# EAGLE design LME49600_HPA (EAGLE 7.2.0)
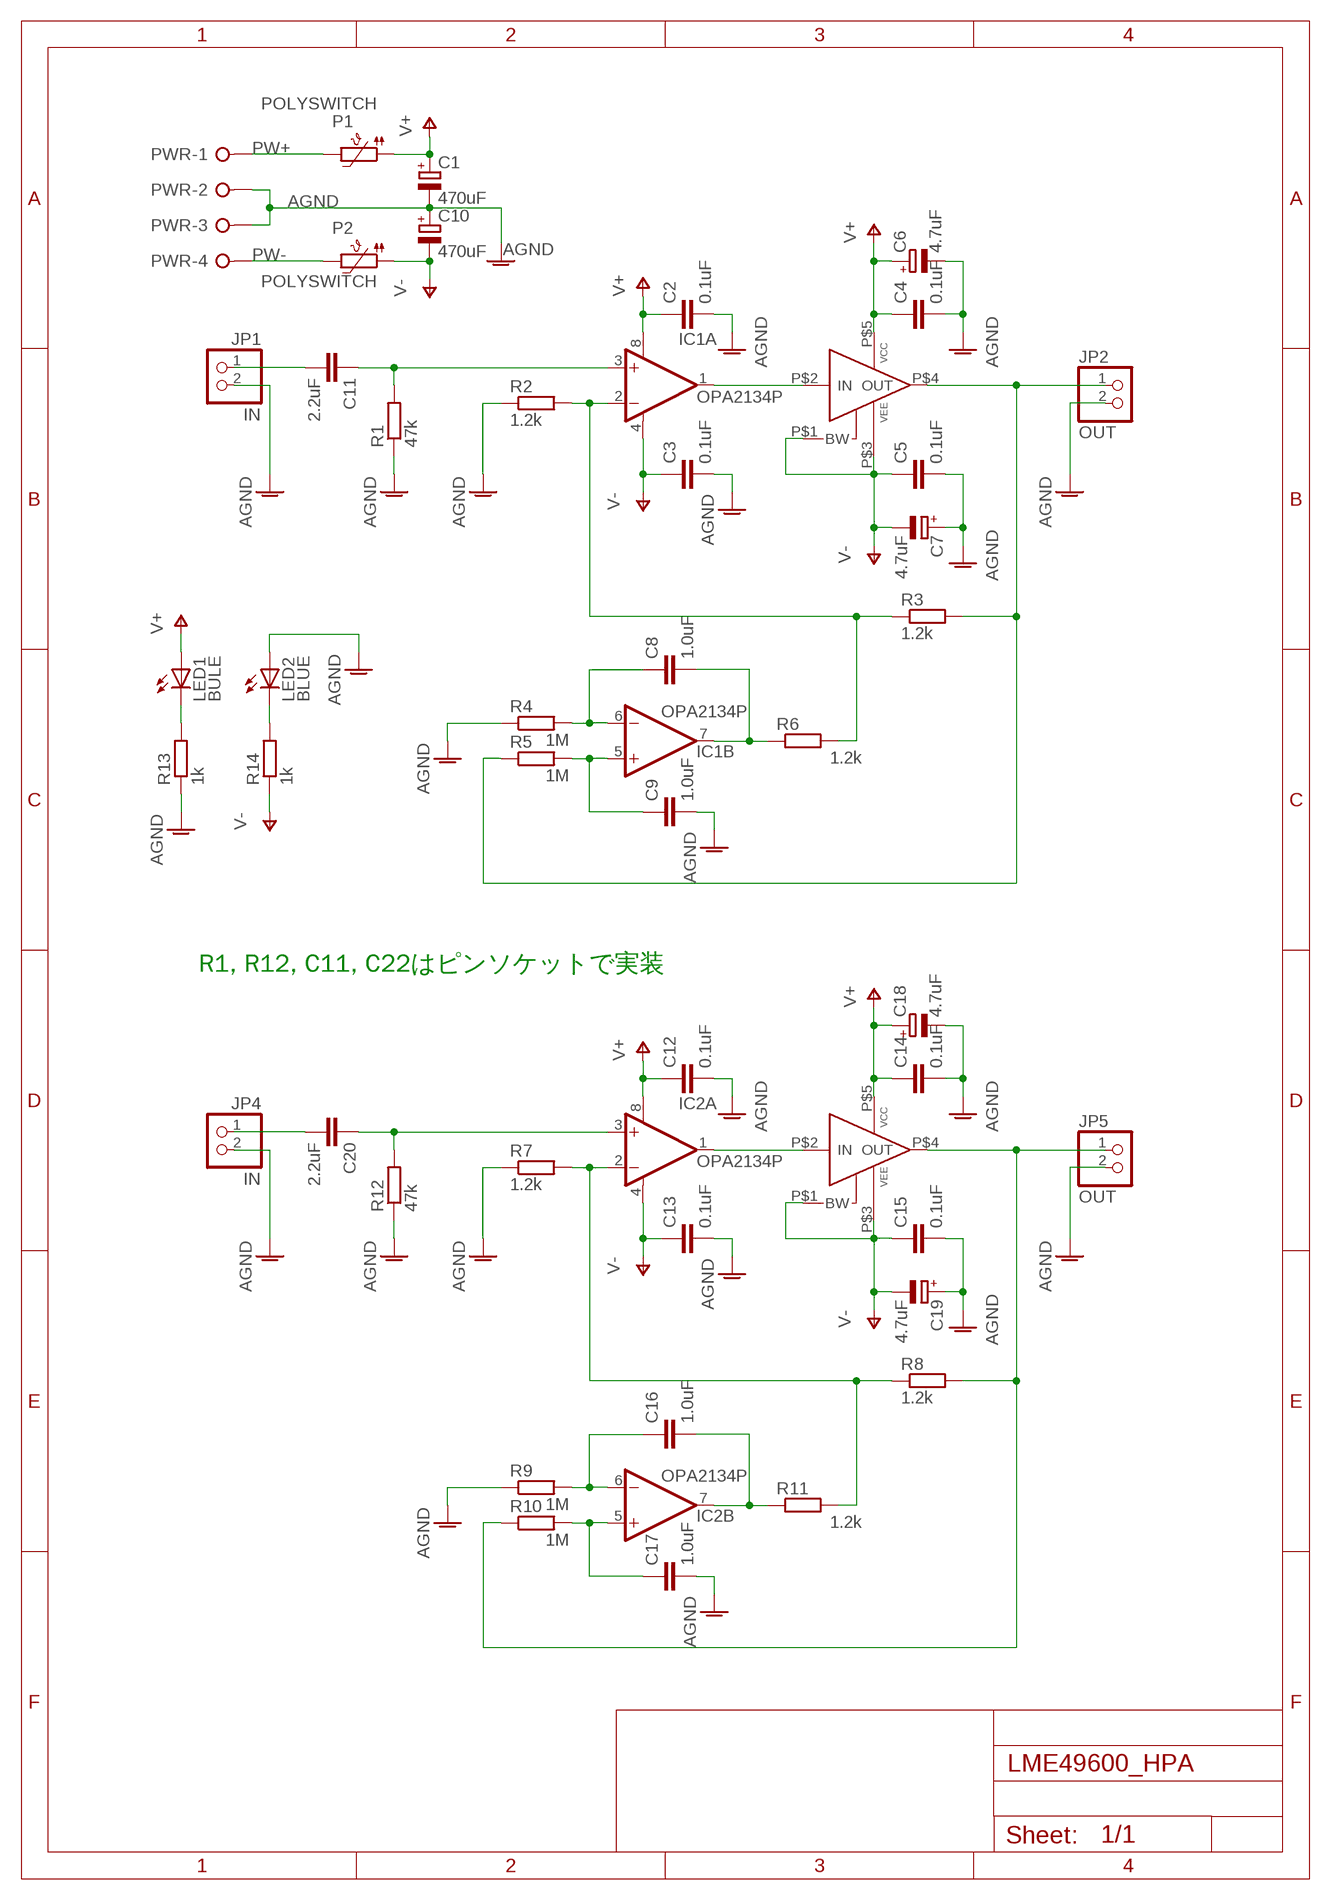
[diagram p0: schematic, sheet 1]

## Parts
C1  470uF  CPOL-EUE7.5-16  [E7,5-16]
C2  0.1uF  C-EU075-042X103  [C075-042X103]
C3  0.1uF  C-EU075-042X103  [C075-042X103]
C4  0.1uF  C-EU050H075X075  [C050H075X075]
C5  0.1uF  C-EU050H075X075  [C050H075X075]
C6  4.7uF  CPOL-EUE2-4  [E2-4]
C7  4.7uF  CPOL-EUE2-4  [E2-4]
C8  1.0uF  C-EU050-050X075  [C050-050X075]
C9  1.0uF  C-EU050-050X075  [C050-050X075]
C10  470uF  CPOL-EUE7.5-16  [E7,5-16]
C11  2.2uF  C-EU050-055X075  [C050-055X075]
C12  0.1uF  C-EU075-042X103  [C075-042X103]
C13  0.1uF  C-EU075-042X103  [C075-042X103]
C14  0.1uF  C-EU050H075X075  [C050H075X075]
C15  0.1uF  C-EU050H075X075  [C050H075X075]
C16  1.0uF  C-EU050-050X075  [C050-050X075]
C17  1.0uF  C-EU050-050X075  [C050-050X075]
C18  4.7uF  CPOL-EUE2-4  [E2-4]
C19  4.7uF  CPOL-EUE2-4  [E2-4]
C20  2.2uF  C-EU050-055X075  [C050-055X075]
IC1  OPA2134P  [DIL08]
IC2  OPA2134P  [DIL08]
JP1  IN  PINHD-1X2  [1X02]
JP2  OUT  PINHD-1X2  [1X02]
JP4  IN  PINHD-1X2  [1X02]
JP5  OUT  PINHD-1X2  [1X02]
LED1  BULE  LED3MM  [LED3MM]
LED2  BLUE  LED3MM  [LED3MM]
P1  POLYSWITCH  [POLYSWITCH]
P2  POLYSWITCH  [POLYSWITCH]
PWR  W237-04P  [W237-4P]
R1  47k  R-EU_0207/7  [0207/7]
R2  1.2k  R-EU_0207/7  [0207/7]
R3  1.2k  R-EU_0207/7  [0207/7]
R4  1M  R-EU_0207/7  [0207/7]
R5  1M  R-EU_0207/7  [0207/7]
R6  1.2k  R-EU_0207/7  [0207/7]
R7  1.2k  R-EU_0207/7  [0207/7]
R8  1.2k  R-EU_0207/7  [0207/7]
R9  1M  R-EU_0207/7  [0207/7]
R10  1M  R-EU_0207/7  [0207/7]
R11  1.2k  R-EU_0207/7  [0207/7]
R12  47k  R-EU_0207/7  [0207/7]
R13  1k  R-EU_0207/7  [0207/7]
R14  1k  R-EU_0207/7  [0207/7]
U$1  LME49600-BRD2  [SIP5-9]
U$2  LME49600-BRD2  [SIP5-9]

## Nets
AGND: C1.- C2.2 C3.2 C4.2 C5.2 C6.- C7.+ C9.2 C10.+ C12.2 C13.2 C14.2 C15.2 C17.2 C18.- C19.+ JP1.2 JP2.2 JP4.2 JP5.2 LED2.A PWR.2 PWR.3 R1.1 R2.1 R4.1 R7.1 R9.1 R12.1 R13.1
N$1: C11.2 JP1.1
N$2: C11.1 IC1.3(A:+IN) R1.2
N$3: IC1.2(A:-IN) R2.2 R3.1 R6.2
N$4: IC2.2(A:-IN) R7.2 R8.1 R11.2
N$5: IC2.1(A:OUT) U$2.P$2(IN)
N$6: C8.1 IC1.6(B:-IN) R4.2
N$7: IC1.1(A:OUT) U$1.P$2(IN)
N$8: C9.1 IC1.5(B:+IN) R5.2
N$9: C16.1 IC2.6(B:-IN) R9.2
N$10: C17.1 IC2.5(B:+IN) R10.2
N$11: C8.2 IC1.7(B:OUT) R6.1
N$12: C16.2 IC2.7(B:OUT) R11.1
N$13: JP5.1 R8.2 R10.1 U$2.P$4(OUT)
N$14: JP2.1 R3.2 R5.1 U$1.P$4(OUT)
N$15: C20.2 JP4.1
N$16: C20.1 IC2.3(A:+IN) R12.2
N$17: LED1.K(C) R13.2
N$19: LED2.K(C) R14.2
PW+: P1.2 PWR.1
PW-: P2.2 PWR.4
V+: C1.+ C2.1 C4.1 C6.+ C12.1 C14.1 C18.+ IC1.8(A:V+) IC2.8(A:V+) LED1.A P1.1 U$1.P$5(VCC) U$2.P$5(VCC)
V-: C3.1 C5.1 C7.- C10.- C13.1 C15.1 C19.- IC1.4(A:V-) IC2.4(A:V-) P2.1 R14.1 U$1.P$1(BW) U$1.P$3(VEE) U$2.P$1(BW) U$2.P$3(VEE)

## Notes on the sheet
- R1, R12, C11, C22はピンソケットで実装

## Library data of the parts
C1 C6 C7 C10 C18 C19 = rcl:CPOL-EU: POLARIZED CAPACITOR, European symbol
C2-C5 C8 C9 C11-C17 C20 = rcl:C-EU: CAPACITOR, European symbol
IC1 IC2 = burr-brown:OPA2134: Operational Amplifier; MF: TEXAS INSTRUMENTS; MPN: OPA2134PA; OC_FARNELL: 1097574; OC_NEWARK: 74K3897
JP1 JP2 JP4 JP5 = pinhead:PINHD-1X2: PIN HEADER
LED1 LED2 = led:LED: LED OSRAM: - CHIPLED LG R971, LG N971, LY N971, LG Q971, LY Q971, LO R971, LY R971 LH N974, LH R974 LS Q976, LO Q976, LY Q976 LO Q996 - Hyper CHIPLED LW Q18S LB Q993, LB Q99A, LB R99A - SideLED LS A670, LO A670, LY A670, LG A670, LP A670 LB A673, LV A673, LT A673, LW A673 LH A674 LY A675 LS A676, LA A676, LO A676, LY A676, LW A676 LS A679, LY A679, LG A679 - Hyper Micro SIDELED® LS Y876, LA Y876, LO Y876, LY Y876 LT Y87S - SmartLED LW L88C, LW L88S LB L89C, LB L89S, LG L890 LS L89K, LO L89K, LY L89K LS L896, LA L896, LO L896, LY L896 - TOPLED LS T670, LO T670, LY T670, LG T670, LP T670 LSG T670, LSP T670, LSY T670, LOP T670, LYG T670 LG T671, LOG T671, LSG T671 LB T673, LV T673, LT T673, LW T673 LH T674 LS T676, LA T676, LO T676, LY T676, LB T676, LH T676, LSB T676, LW T676 LB T67C, LV T67C, LT T67C, LS T67K, LO T67K, LY T67K, LW E67C LS E67B, LA E67B, LO E67B, LY E67B, LB E67C, LV E67C, LT E67C LW T67C LS T679, LY T679, LG T679 LS T770, LO T770, LY T770, LG T770, LP T770 LB T773, LV T773, LT T773, LW T773 LH T774 LS E675, LA E675, LY E675, LS T675 LS T776, LA T776, LO T776, LY T776, LB T776 LHGB T686 LT T68C, LB T68C - Hyper Mini TOPLED® LB M676 - Mini TOPLED Santana® LG M470 LS M47K, LO M47K, LY M47K Source: http://www.osram.convergy.de LUXEON: - LUMILED® LXK2-PW12-R00, LXK2-PW12-S00, LXK2-PW14-U00, LXK2-PW14-V00 LXK2-PM12-R00, LXK2-PM12-S00, LXK2-PM14-U00 LXK2-PE12-Q00, LXK2-PE12-R00, LXK2-PE12-S00, LXK2-PE14-T00, LXK2-PE14-U00 LXK2-PB12-K00, LXK2-PB12-L00, LXK2-PB12-M00, LXK2-PB14-N00, LXK2-PB14-P00, LXK2-PB14-Q00 LXK2-PR12-L00, LXK2-PR12-M00, LXK2-PR14-Q00, LXK2-PR14-R00 LXK2-PD12-Q00, LXK2-PD12-R00, LXK2-PD12-S00 LXK2-PH12-R00, LXK2-PH12-S00 LXK2-PL12-P00, LXK2-PL12-Q00, LXK2-PL12-R00 Source: www.luxeon.com KINGBRIGHT: KA-3528ASYC Source: www.kingbright.com
P1 P2 = mylib2:POLYSWITCH
PWR = con-wago-508:W237-04P: WAGO SREW CLAMP; OC_FARNELL: unknown; OC_NEWARK: unknown
R1-R14 = rcl:R-EU_: RESISTOR, European symbol
U$1 U$2 = mylib2:LME49600-BRD2

## Board
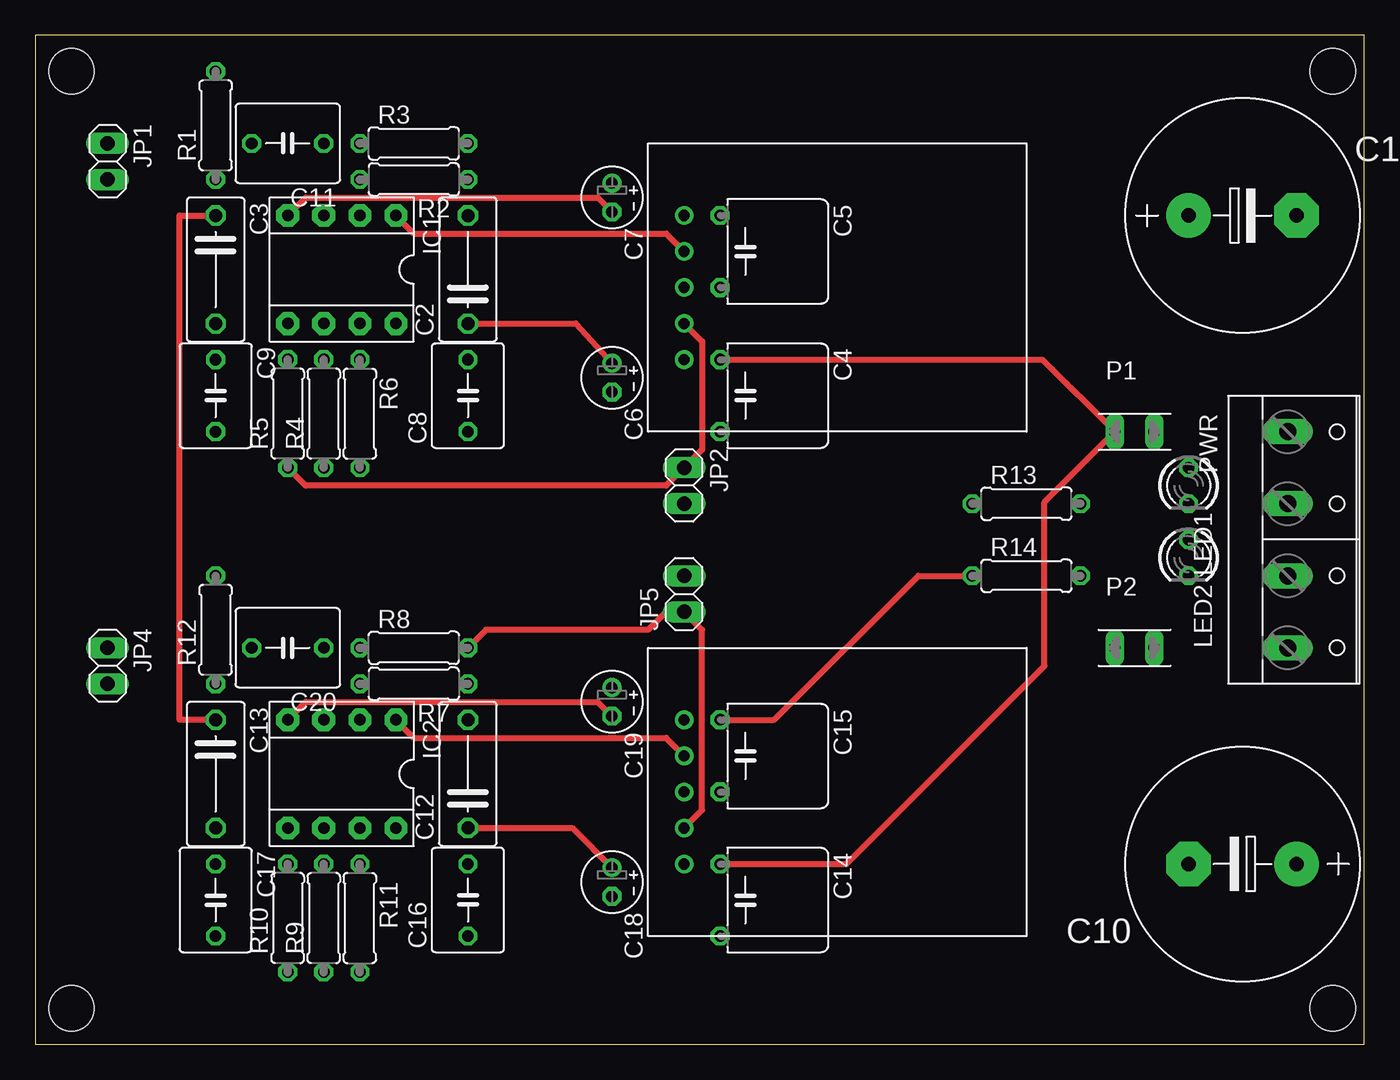
[diagram p1: board, top side]
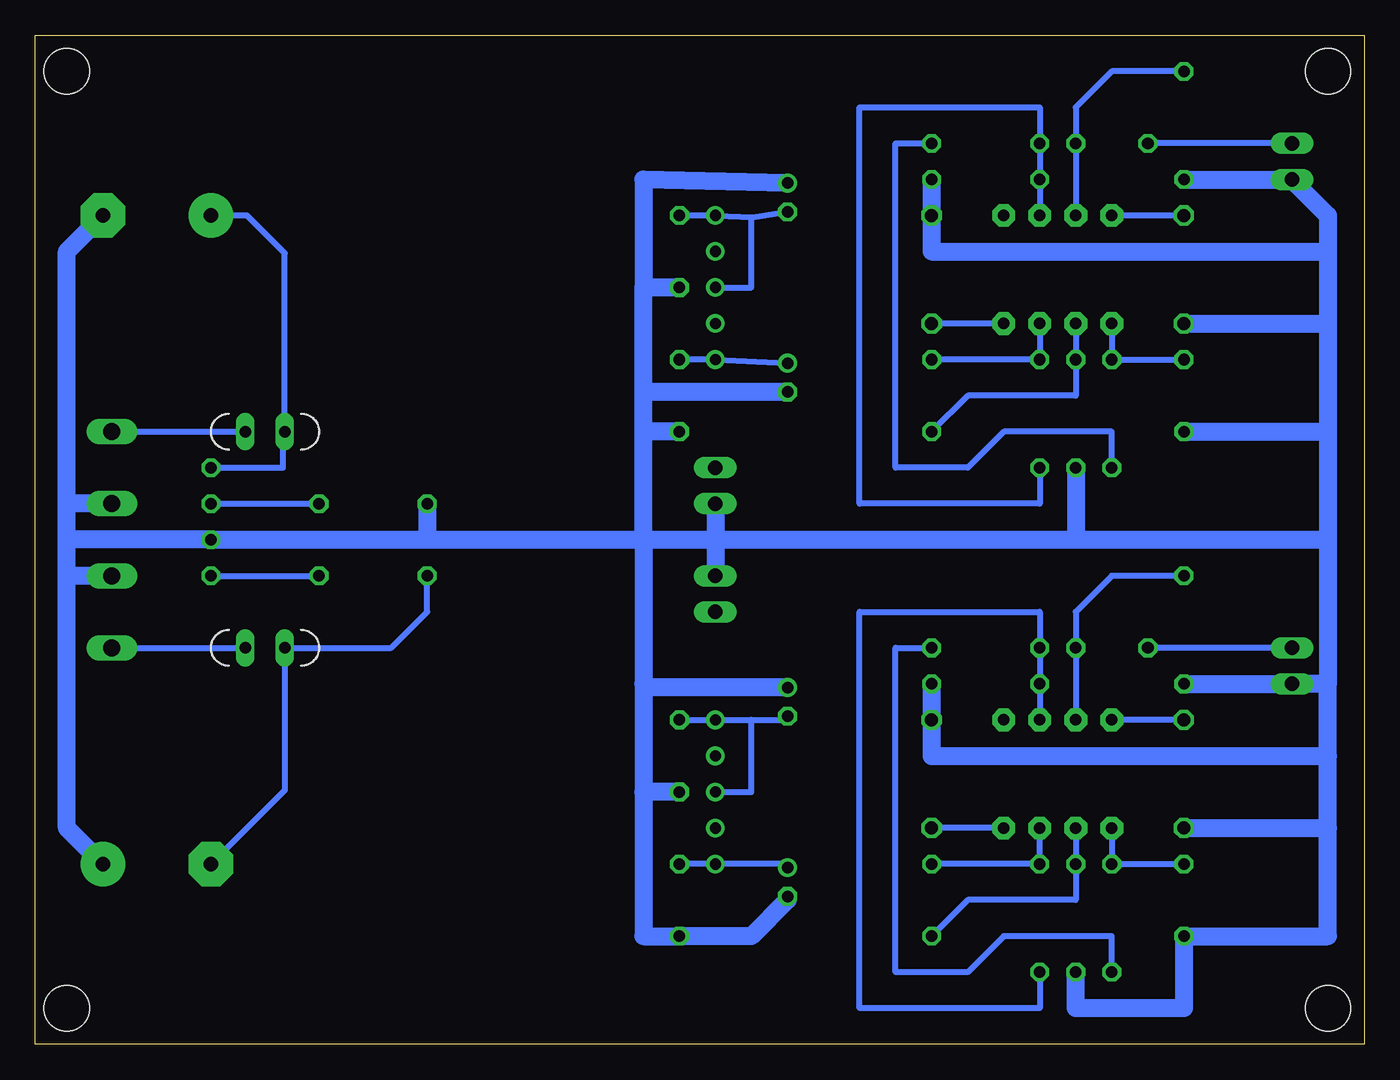
[diagram p2: board, bottom side, seen from below]

Size 93.65 x 71.11 mm. Coordinates in mm from the lower left corner, seen from the top.
Outline: 0,0 93.65,0 93.65,71.11 0,71.11 0,0
Copper layers (1*16): Top 0.035mm / dielectric 1.5mm / Bottom 0.035mm
Design rules "default": minimum track width 10mil, minimum drill 24mil, track to track 8mil, track to pad 8mil, pad to pad 8mil, via to via 8mil, smd to smd 8mil, copper to edge 40mil, drill to drill 8mil, minimum pad ring 10mil, minimum via ring 8mil, stop-mask expansion 4mil, vias tented up to drill 0mil, thermal gap 10mil
Holes 3.2 mm at 2.54,68.58 2.54,2.54 91.44,2.54 91.44,68.58

### Footprints (pad centres in the part's own frame; a part is rotated, then mirrored left to right if it is on the bottom)
E7,5-16 = drill 1.016 pad 3.15: + -3.81,0 | drill 1.016 pad 3.15 octagon: - 3.81,0
C075-042X103 = drill 0.914 octagon: 1 -3.81,0; 2 3.81,0
C050H075X075 = drill 0.813 octagon: 1 -2.54,0; 2 2.54,0
E2-4 = drill 0.813 pad 1.27: + -1.016,0 | drill 0.813 pad 1.27 octagon: - 1.016,0
C050-050X075 = drill 0.813 octagon: 1 -2.54,0; 2 2.54,0
C050-055X075 = drill 0.813 octagon: 1 -2.54,0; 2 2.54,0
DIL08 = drill 0.813 pad 1.6 octagon: 1 -3.81,-3.81; 2 -1.27,-3.81; 3 1.27,-3.81; 4 3.81,-3.81; 5 3.81,3.81; 6 1.27,3.81; 7 -1.27,3.81; 8 -3.81,3.81
1X02 = drill 1.016 long: 1 -1.27,0; 2 1.27,0
LED3MM = drill 0.813 octagon: A -1.27,0; K 1.27,0
POLYSWITCH = drill 0.813 long: 1 -1.397,0; 2 1.397,0
W237-4P = drill 1.194 long: 1 -7.62,-0.635; 2 -2.54,-0.635; 3 2.54,-0.635; 4 7.62,-0.635
0207/7 = drill 0.813 octagon: 1 -3.81,0; 2 3.81,0
SIP5-9 = drill 0.8: P$1 -5.08,-7.62; P$2 -2.54,-7.62; P$3 0,-7.62; P$4 2.54,-7.62; P$5 5.08,-7.62

### Placement (x,y rotation side)
C1  85.09,58.42 0 top
C2  30.48,54.61 90 top
C3  12.7,54.61 270 top
C4  48.26,45.72 270 top
C5  48.26,55.88 270 top
C6  40.64,46.99 270 top
C7  40.64,59.69 270 top
C8  30.48,45.72 90 top
C9  12.7,45.72 270 top
C10  85.09,12.7 180 top
C11  17.78,63.5 180 top
C12  30.48,19.05 90 top
C13  12.7,19.05 270 top
C14  48.26,10.16 270 top
C15  48.26,20.32 270 top
C16  30.48,10.16 90 top
C17  12.7,10.16 270 top
C18  40.64,11.43 270 top
C19  40.64,24.13 270 top
C20  17.78,27.94 180 top
IC1  21.59,54.61 180 top
IC2  21.59,19.05 180 top
JP1  5.08,62.23 270 top
JP2  45.72,39.37 270 top
JP4  5.08,26.67 270 top
JP5  45.72,31.75 90 top
LED1  81.28,39.37 270 top
LED2  81.28,34.29 270 top
P1  77.47,43.18 0 top
P2  77.47,27.94 0 top
PWR  88.9,35.56 270 top
R1  12.7,64.77 90 top
R2  26.67,60.96 180 top
R3  26.67,63.5 0 top
R4  20.32,44.45 90 top
R5  17.78,44.45 90 top
R6  22.86,44.45 270 top
R7  26.67,25.4 180 top
R8  26.67,27.94 0 top
R9  20.32,8.89 90 top
R10  17.78,8.89 90 top
R11  22.86,8.89 270 top
R12  12.7,29.21 90 top
R13  69.85,38.1 0 top
R14  69.85,33.02 0 top
U$1  53.34,53.34 270 top
U$2  53.34,17.78 270 top

### Tracks (layer width: path | path; a pad name or v marks a point on that pad's centre or on a via)
AGND
  Bottom 0.406: 50.55,25.15 50.8,25.4 | R2.1 C2.2 | C18.- 40.64,10.16
  Bottom 1.27: R12.1 JP4.2 2.54,25.4 | C13.2 2.54,15.24 | 2.54,15.24 2.54,7.62 C17.2 12.7,2.54 20.32,2.54 R9.1 | C19.+ 50.55,25.15 | 50.8,17.78 50.8,25.4 50.8,35.56 | 2.54,15.24 2.54,20.32 | 2.54,20.32 2.54,25.4 | 2.54,55.88 2.54,58.42 JP1.2 R1.1 | 2.54,55.88 2.54,50.8 | 2.54,50.8 2.54,43.18 | 2.54,43.18 2.54,35.56 | C9.2 2.54,43.18 | C3.2 2.54,50.8 | C7.+ 50.8,60.96 50.8,53.34 | C15.2 50.8,17.78 | 50.8,17.78 50.8,7.62 C14.2 43.18,7.62 40.64,10.16 | C5.2 50.8,53.34 | 50.8,35.56 50.8,43.18 | 50.8,43.18 50.8,45.97 | 50.8,45.97 50.8,53.34 | R7.1 C12.2 30.48,20.32 2.54,20.32 | R2.1 30.48,55.88 2.54,55.88 | 66.04,35.56 LED2.A 91.44,35.56 | 66.04,35.56 50.8,35.56 | R13.1 66.04,35.56 | C1.- 91.44,55.88 91.44,38.1 | C10.+ 91.44,15.24 91.44,33.02 | 91.44,33.02 91.44,35.56 | 91.44,35.56 91.44,38.1 | 45.72,35.56 JP5.2 | 2.54,35.56 2.54,25.4 | 50.8,35.56 45.72,35.56 | 45.72,35.56 20.32,35.56 | 20.32,35.56 2.54,35.56 | JP2.2 45.72,35.56 | R4.1 20.32,35.56 | PWR.2 91.44,38.1 | PWR.3 91.44,33.02 | C6.- 50.8,45.97 | C4.2 50.8,43.18
N$1
  Bottom 0.406: JP1.1 C11.2
N$2
  Bottom 0.406: IC1.3 C11.1 20.32,66.04 17.78,68.58 R1.2
N$3
  Bottom 0.406: IC1.2 R2.2 R3.1 22.86,66.04 35.56,66.04 35.56,38.1 22.86,38.1 R6.2
N$4
  Bottom 0.406: IC2.2 R7.2 R8.1 22.86,30.48 35.56,30.48 35.56,2.54 22.86,2.54 R11.2
N$5
  Top 0.406: IC2.1 26.67,21.59 44.45,21.59 U$2.P$2
N$6
  Bottom 0.406: IC1.6 R4.2 20.32,45.72 27.94,45.72 C8.1
N$7
  Top 0.406: IC1.1 26.67,57.15 44.45,57.15 U$1.P$2
N$8
  Bottom 0.406: IC1.5 R5.2 C9.1
N$9
  Bottom 0.406: IC2.6 R9.2 20.32,10.16 27.94,10.16 C16.1
N$10
  Bottom 0.406: IC2.5 R10.2 C17.1
N$11
  Bottom 0.406: IC1.7 R6.1 C8.2
N$12
  Bottom 0.406: IC2.7 R11.1 C16.2
N$13
  Top 0.406: R8.2 31.75,29.21 43.18,29.21 44.45,30.48 JP5.1 46.99,29.21 46.99,16.51 U$2.P$4
  Bottom 0.406: R10.1 17.78,7.62 25.4,7.62 27.94,5.08 33.02,5.08 33.02,27.94 R8.2
N$14
  Top 0.406: R5.1 19.05,39.37 44.45,39.37 JP2.1 46.99,41.91 46.99,49.53 U$1.P$4
  Bottom 0.406: R5.1 17.78,43.18 25.4,43.18 27.94,40.64 33.02,40.64 33.02,63.5 R3.2
N$15
  Bottom 0.406: JP4.1 C20.2
N$16
  Bottom 0.406: R12.2 17.78,33.02 20.32,30.48 C20.1 IC2.3
N$17
  Bottom 0.406: LED1.K R13.2
N$19
  Bottom 0.406: LED2.K R14.2
PW+
  Bottom 0.406: PWR.1 P1.2
PW-
  Bottom 0.406: PWR.4 P2.2
V+
  Top 0.406: C2.1 38.1,50.8 C6.+ | C12.1 37.85,15.24 C18.+ | C4.1 70.99,48.26 P1.1 71.12,38.23 71.12,26.67 57.15,12.7 C14.1
  Bottom 0.406: C18.+ 40.89,12.7 U$2.P$5 C14.1 | C4.1 U$1.P$5 C6.+ | IC1.8 C2.1 | IC2.8 C12.1 | C1.+ 78.74,58.42 76.07,55.75 P1.1 76.2,43.05 76.2,40.64 LED1.A
V-
  Top 0.406: IC1.4 19.05,59.69 39.62,59.69 C7.- | IC2.4 19.05,24.13 39.62,24.13 C19.- | C15.1 52.07,22.86 62.23,33.02 R14.1 | C13.1 10.16,22.86 10.16,58.42 C3.1
  Bottom 0.406: C15.1 U$2.P$1 43.18,22.86 | 43.18,22.86 40.89,22.86 C19.- | U$2.P$3 43.18,17.78 43.18,22.86 | C3.1 IC1.4 | 43.06,58.29 U$1.P$1 C5.1 | 43.06,58.29 C7.- | 43.06,58.29 43.18,58.17 43.18,53.34 U$1.P$3 | C10.- 76.07,17.91 P2.1 68.58,27.94 66.04,30.48 R14.1 | C13.1 IC2.4